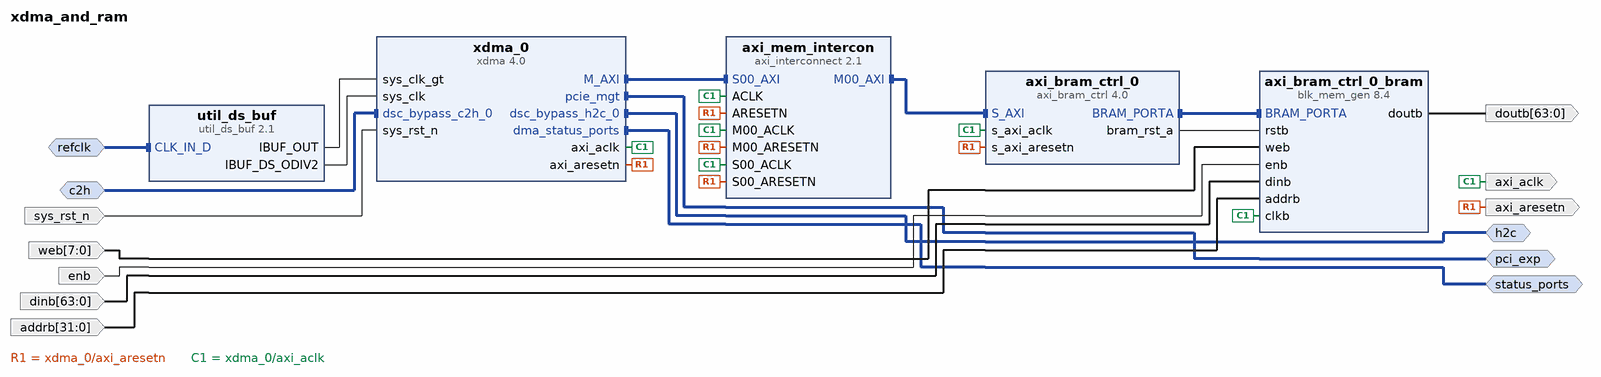
[diagram p0: block diagram of the top level]
# Vivado block design xdma_and_ram, xcku040-ffva1156-2-e, Vivado 2017.4
create_bd_design xdma_and_ram

create_bd_intf_port -mode Master -vlnv xilinx.com:interface:pcie_7x_mgt_rtl:1.0 pci_exp
create_bd_intf_port -mode Slave -vlnv xilinx.com:interface:diff_clock_rtl:1.0 refclk
set_property -dict {CONFIG.FREQ_HZ 100000000} [get_bd_intf_ports refclk]
create_bd_intf_port -mode Slave -vlnv xilinx.com:display_xdma:dsc_bypass_rtl:1.0 c2h
create_bd_intf_port -mode Master -vlnv xilinx.com:display_xdma:dsc_bypass_rtl:1.0 h2c
create_bd_intf_port -mode Master -vlnv xilinx.com:display_xdma:xdma_status_ports_rtl:1.0 status_ports
create_bd_port -dir I -type rst sys_rst_n
set_property -dict {CONFIG.POLARITY ACTIVE_LOW} [get_bd_ports sys_rst_n]
create_bd_port -dir I -from 7 -to 0 web
create_bd_port -dir O -type rst axi_aresetn
create_bd_port -dir O -type clk axi_aclk
set_property -dict {CONFIG.ASSOCIATED_BUSIF s_axil} [get_bd_ports axi_aclk]
create_bd_port -dir I enb
create_bd_port -dir I -from 63 -to 0 dinb
create_bd_port -dir I -from 31 -to 0 addrb
create_bd_port -dir O -from 63 -to 0 doutb

create_bd_cell -type ip -vlnv xilinx.com:ip:axi_bram_ctrl:4.0 axi_bram_ctrl_0
set_property -dict {CONFIG.DATA_WIDTH 64 CONFIG.SINGLE_PORT_BRAM 1} [get_bd_cells axi_bram_ctrl_0]
create_bd_cell -type ip -vlnv xilinx.com:ip:util_ds_buf:2.1 util_ds_buf
set_property -dict {CONFIG.C_BUF_TYPE IBUFDSGTE} [get_bd_cells util_ds_buf]
create_bd_cell -type ip -vlnv xilinx.com:ip:axi_interconnect:2.1 axi_mem_intercon
set_property -dict {CONFIG.NUM_MI 1} [get_bd_cells axi_mem_intercon]
create_bd_cell -type ip -vlnv xilinx.com:ip:blk_mem_gen:8.4 axi_bram_ctrl_0_bram
set_property -dict [list \
  CONFIG.Memory_Type True_Dual_Port_RAM \
  CONFIG.Enable_B Use_ENB_Pin \
  CONFIG.Use_RSTB_Pin true \
  CONFIG.Port_B_Clock 100 \
  CONFIG.Port_B_Write_Rate 50 \
  CONFIG.Port_B_Enable_Rate 100 \
] [get_bd_cells axi_bram_ctrl_0_bram]
create_bd_cell -type ip -vlnv xilinx.com:ip:xdma:4.0 xdma_0
set_property -dict [list \
  CONFIG.mode_selection Advanced \
  CONFIG.pl_link_cap_max_link_width X8 \
  CONFIG.pl_link_cap_max_link_speed 8.0_GT/s \
  CONFIG.axi_data_width 256_bit \
  CONFIG.axisten_freq 250 \
  CONFIG.pf0_device_id 8038 \
  CONFIG.xdma_rnum_chnl 2 \
  CONFIG.xdma_wnum_chnl 2 \
  CONFIG.xdma_axilite_slave false \
  CONFIG.plltype QPLL1 \
  CONFIG.xdma_axi_intf_mm AXI_Memory_Mapped \
  CONFIG.dsc_bypass_rd 0001 \
  CONFIG.dsc_bypass_wr 0001 \
  CONFIG.xdma_sts_ports true \
  CONFIG.cfg_mgmt_if false \
  CONFIG.PF0_DEVICE_ID_mqdma 9038 \
  CONFIG.PF2_DEVICE_ID_mqdma 9038 \
  CONFIG.PF3_DEVICE_ID_mqdma 9038 \
] [get_bd_cells xdma_0]

# ---- connections ----

connect_bd_intf_net [get_bd_intf_pins xdma_0/M_AXI] [get_bd_intf_pins axi_mem_intercon/S00_AXI]
connect_bd_intf_net [get_bd_intf_pins axi_mem_intercon/M00_AXI] [get_bd_intf_pins axi_bram_ctrl_0/S_AXI]
connect_bd_intf_net [get_bd_intf_pins axi_bram_ctrl_0_bram/BRAM_PORTA] [get_bd_intf_pins axi_bram_ctrl_0/BRAM_PORTA]
connect_bd_intf_net [get_bd_intf_ports pci_exp] [get_bd_intf_pins xdma_0/pcie_mgt]
connect_bd_intf_net -intf_net diff_clock_rtl_0_1 [get_bd_intf_ports refclk] [get_bd_intf_pins util_ds_buf/CLK_IN_D]
connect_bd_intf_net -intf_net dsc_bypass_c2h_0_0_1 [get_bd_intf_ports c2h] [get_bd_intf_pins xdma_0/dsc_bypass_c2h_0]
connect_bd_intf_net [get_bd_intf_ports h2c] [get_bd_intf_pins xdma_0/dsc_bypass_h2c_0]
connect_bd_intf_net [get_bd_intf_ports status_ports] [get_bd_intf_pins xdma_0/dma_status_ports]
connect_bd_net -net reset_rtl_0_1 [get_bd_ports sys_rst_n] [get_bd_pins xdma_0/sys_rst_n]
connect_bd_net [get_bd_pins util_ds_buf/IBUF_OUT] [get_bd_pins xdma_0/sys_clk_gt]
connect_bd_net [get_bd_pins util_ds_buf/IBUF_DS_ODIV2] [get_bd_pins xdma_0/sys_clk]
connect_bd_net -net web_0_1 [get_bd_ports web] [get_bd_pins axi_bram_ctrl_0_bram/web]
connect_bd_net [get_bd_pins xdma_0/axi_aresetn] \
  [get_bd_ports axi_aresetn] [get_bd_pins axi_bram_ctrl_0/s_axi_aresetn] [get_bd_pins axi_mem_intercon/S00_ARESETN] \
  [get_bd_pins axi_mem_intercon/M00_ARESETN] [get_bd_pins axi_mem_intercon/ARESETN]
connect_bd_net [get_bd_pins xdma_0/axi_aclk] \
  [get_bd_ports axi_aclk] [get_bd_pins axi_bram_ctrl_0/s_axi_aclk] [get_bd_pins axi_bram_ctrl_0_bram/clkb] \
  [get_bd_pins axi_mem_intercon/S00_ACLK] [get_bd_pins axi_mem_intercon/M00_ACLK] [get_bd_pins axi_mem_intercon/ACLK]
connect_bd_net -net enb_0_1 [get_bd_ports enb] [get_bd_pins axi_bram_ctrl_0_bram/enb]
connect_bd_net [get_bd_pins axi_bram_ctrl_0/bram_rst_a] [get_bd_pins axi_bram_ctrl_0_bram/rstb]
connect_bd_net -net dinb_0_1 [get_bd_ports dinb] [get_bd_pins axi_bram_ctrl_0_bram/dinb]
connect_bd_net -net addrb_0_1 [get_bd_ports addrb] [get_bd_pins axi_bram_ctrl_0_bram/addrb]
connect_bd_net [get_bd_pins axi_bram_ctrl_0_bram/doutb] [get_bd_ports doutb]

# ---- address map ----
assign_bd_address -offset 0x00000000C0000000 -range 8K -target_address_space [get_bd_addr_spaces xdma_0/M_AXI] [get_bd_addr_segs axi_bram_ctrl_0/S_AXI/Mem0]

validate_bd_design
save_bd_design
